# Altium schematic sheet Flybox2_main_board.SchDoc: FlyBox 2 main board
size A4; Author: Andrea Mancini; DocumentNumber: 1; Revision: 1; SheetNumber: 1; SheetTotal: 3; FileName: Flybox2_main_board.SchDoc; DescriptionLine1: socket board to fit; DescriptionLine2: modules and pins for button; DescriptionLine3: pad, pots and encoders
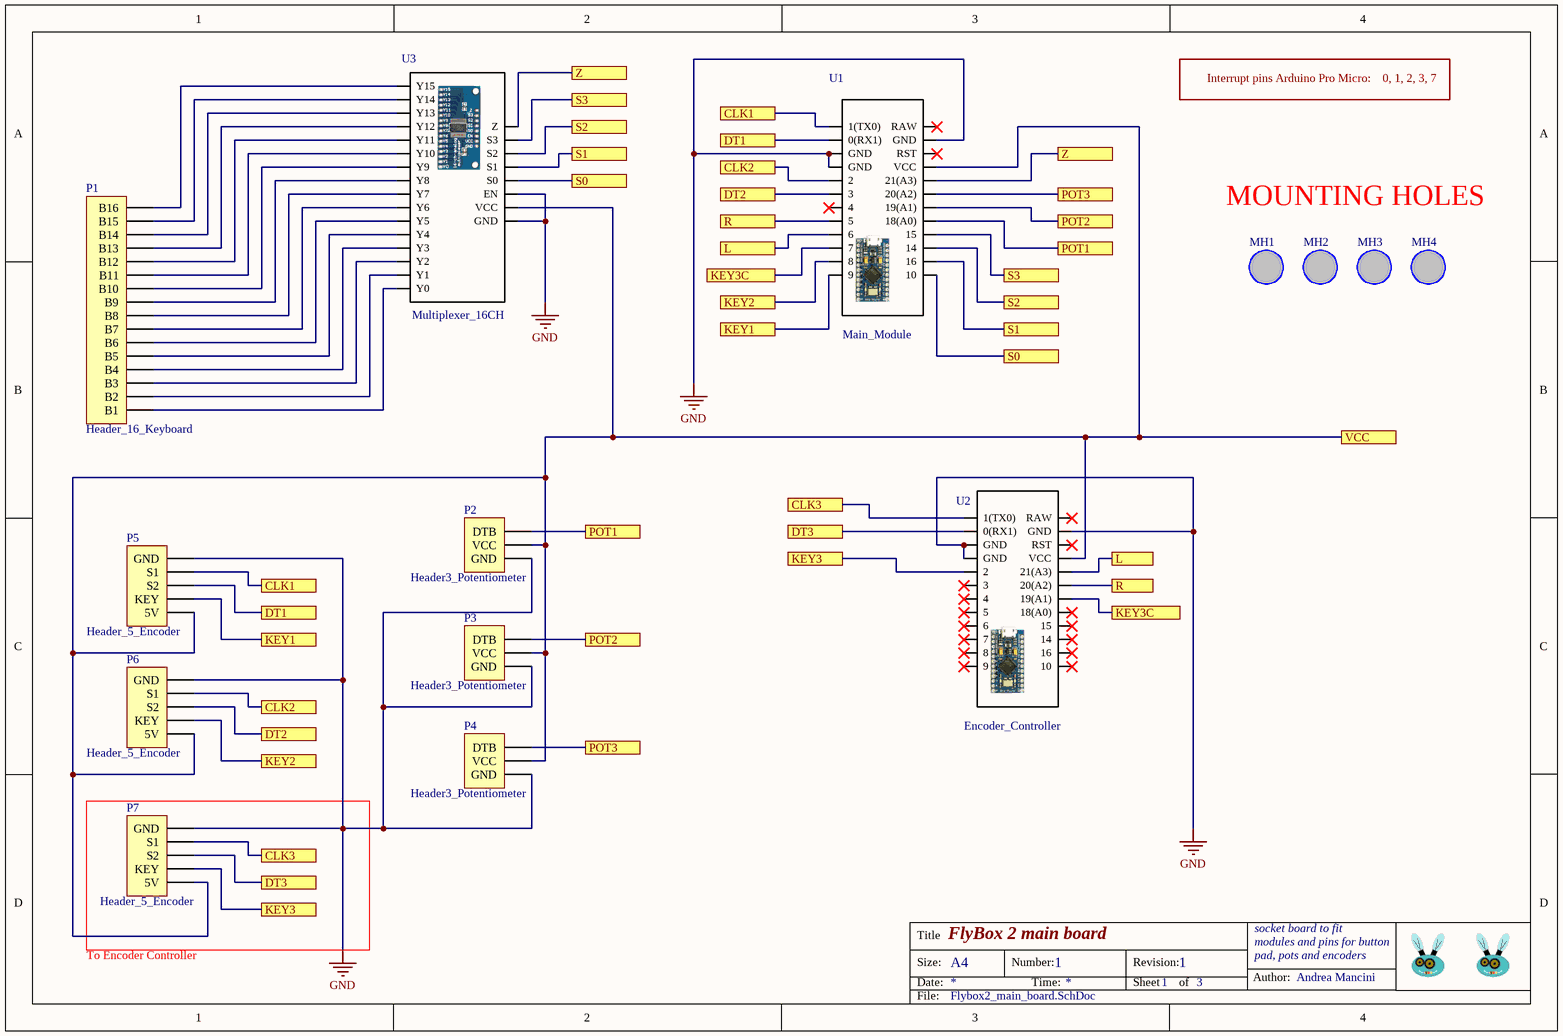
[diagram p0: Flybox2_main_board.SchDoc]

## Parts
MH1  Mounting Hole 3.2mm Drill  [MH_3.2MMD]  (value not drawn)  (no BOM)
MH2  Mounting Hole 3.2mm Drill  [MH_3.2MMD]  (value not drawn)  (no BOM)
MH3  Mounting Hole 3.2mm Drill  [MH_3.2MMD]  (value not drawn)  (no BOM)
MH4  Mounting Hole 3.2mm Drill  [MH_3.2MMD]  (value not drawn)  (no BOM)
P1  Header_16_Keyboard  [HDR1X16_Buttons]
P2  Header3_Potentiometer  [HDR1X3_Potentiometer]
P3  Header3_Potentiometer  [HDR1X3_Potentiometer]
P4  Header3_Potentiometer  [HDR1X3_Potentiometer]
P5  Header_5_Encoder  [HDR1X5_Encoder]
P6  Header_5_Encoder  [HDR1X5_Encoder]
P7  Header_5_Encoder  [HDR1X5_Encoder]
U1  Main_Module  [Arduino_Pro_Micro_Board]
U2  Encoder_Controller  [Arduino_Pro_Micro_Board]
U3  Multiplexer_16CH  [Multiplexer_16CH]

## Ports
CLK1, CLK2, CLK3, DT1, DT2, DT3, KEY1, KEY2, KEY3, KEY3C, L, POT1, POT2, POT3, R, S0, S1, S2, S3, VCC, Z

## Nets
GND: P2.1(GND) P3.1(GND) P4.1(GND) P5.1(GND) P6.1(GND) P7.1(GND) U1.3(GND) U1.4(GND) U1.14(GND) U2.3(GND) U2.4(GND) U2.14(GND) U3.17(GND) U3.19(EN)
CLK1: P5.2(S1) U1.1(1(TX0)) ; port CLK1
CLK2: P6.2(S1) U1.5(2) ; port CLK2
CLK3: P7.2(S1) U2.1(1(TX0)) ; port CLK3
DT1: P5.3(S2) U1.2(0(RX1)) ; port DT1
DT2: P6.3(S2) U1.6(3) ; port DT2
DT3: P7.3(S2) U2.2(0(RX1)) ; port DT3
KEY1: P5.4(KEY) U1.12(9) ; port KEY1
KEY2: P6.4(KEY) U1.11(8) ; port KEY2
KEY3: P7.4(KEY) U2.5(2) ; port KEY3
KEY3C: U1.10(7) U2.19(19(A1)) ; port KEY3C
L: U1.9(6) U2.17(21(A3)) ; port L
POT1: P2.3(DTB) U1.20(18(A0)) ; port POT1
POT2: P3.3(DTB) U1.19(19(A1)) ; port POT2
POT3: P4.3(DTB) U1.18(20(A2)) ; port POT3
R: U1.8(5) U2.18(20(A2)) ; port R
S0: U1.24(10) U3.20(S0) ; port S0
S1: U1.23(16) U3.21(S1) ; port S1
S2: U1.22(14) U3.22(S2) ; port S2
S3: U1.21(15) U3.23(S3) ; port S3
VCC: P2.2(VCC) P3.2(VCC) P4.2(VCC) P5.5(5V) P6.5(5V) P7.5(5V) U1.16(VCC) U2.16(VCC) U3.18(VCC) ; port VCC
Z: U1.17(21(A3)) U3.24(Z) ; port Z
NetP1_1: P1.1(B1) U3.1(Y0)
NetP1_2: P1.2(B2) U3.2(Y1)
NetP1_3: P1.3(B3) U3.3(Y2)
NetP1_4: P1.4(B4) U3.4(Y3)
NetP1_5: P1.5(B5) U3.5(Y4)
NetP1_6: P1.6(B6) U3.6(Y5)
NetP1_7: P1.7(B7) U3.7(Y6)
NetP1_8: P1.8(B8) U3.8(Y7)
NetP1_9: P1.9(B9) U3.9(Y8)
NetP1_10: P1.10(B10) U3.10(Y9)
NetP1_11: P1.11(B11) U3.11(Y10)
NetP1_12: P1.12(B12) U3.12(Y11)
NetP1_13: P1.13(B13) U3.13(Y12)
NetP1_14: P1.14(B14) U3.14(Y13)
NetP1_15: P1.15(B15) U3.15(Y14)
NetP1_16: P1.16(B16) U3.16(Y15)

Not connected (* = marked no-connect by the designer): U1 7(4)* 13(RAW)* 15(RST)*; U2 6(3)* 7(4)* 8(5)* 9(6)* 10(7)* 11(8)* 12(9)* 13(RAW)* 15(RST)* 20(18(A0))* 21(15)* 22(14)* 23(16)* 24(10)*

## Notes on the sheet
- Interrupt pins Arduino Pro Micro:
- 0, 1, 2, 3, 7
- MOUNTING HOLES
- To Encoder Controller
- Title
- Size:
- Date:
- A4
- Number:
- Time:
- Revision:
- Sheet
- of
- Author:
- File:

## Library data of the parts
MH1-MH4 = MH_3.2MMD
P5-P7 = Header_5_Encoder: Header 5 pins to connect one encoder
U1 U2 = Arduino_Pro_Micro: Arduino pro micro board